# EasyEDA Pro project ProProject_遥控手柄PCB_2024-01-29.epro

# Schematic Schematic1
Create Date: 2024-01-29; Page Name: P1; Project Name: 遥控手柄PCB; Schematic Name: Schematic1; Update Date: 2024-01-29; Company: 嘉立创EDA; Page Size: A4; Version: V1.0
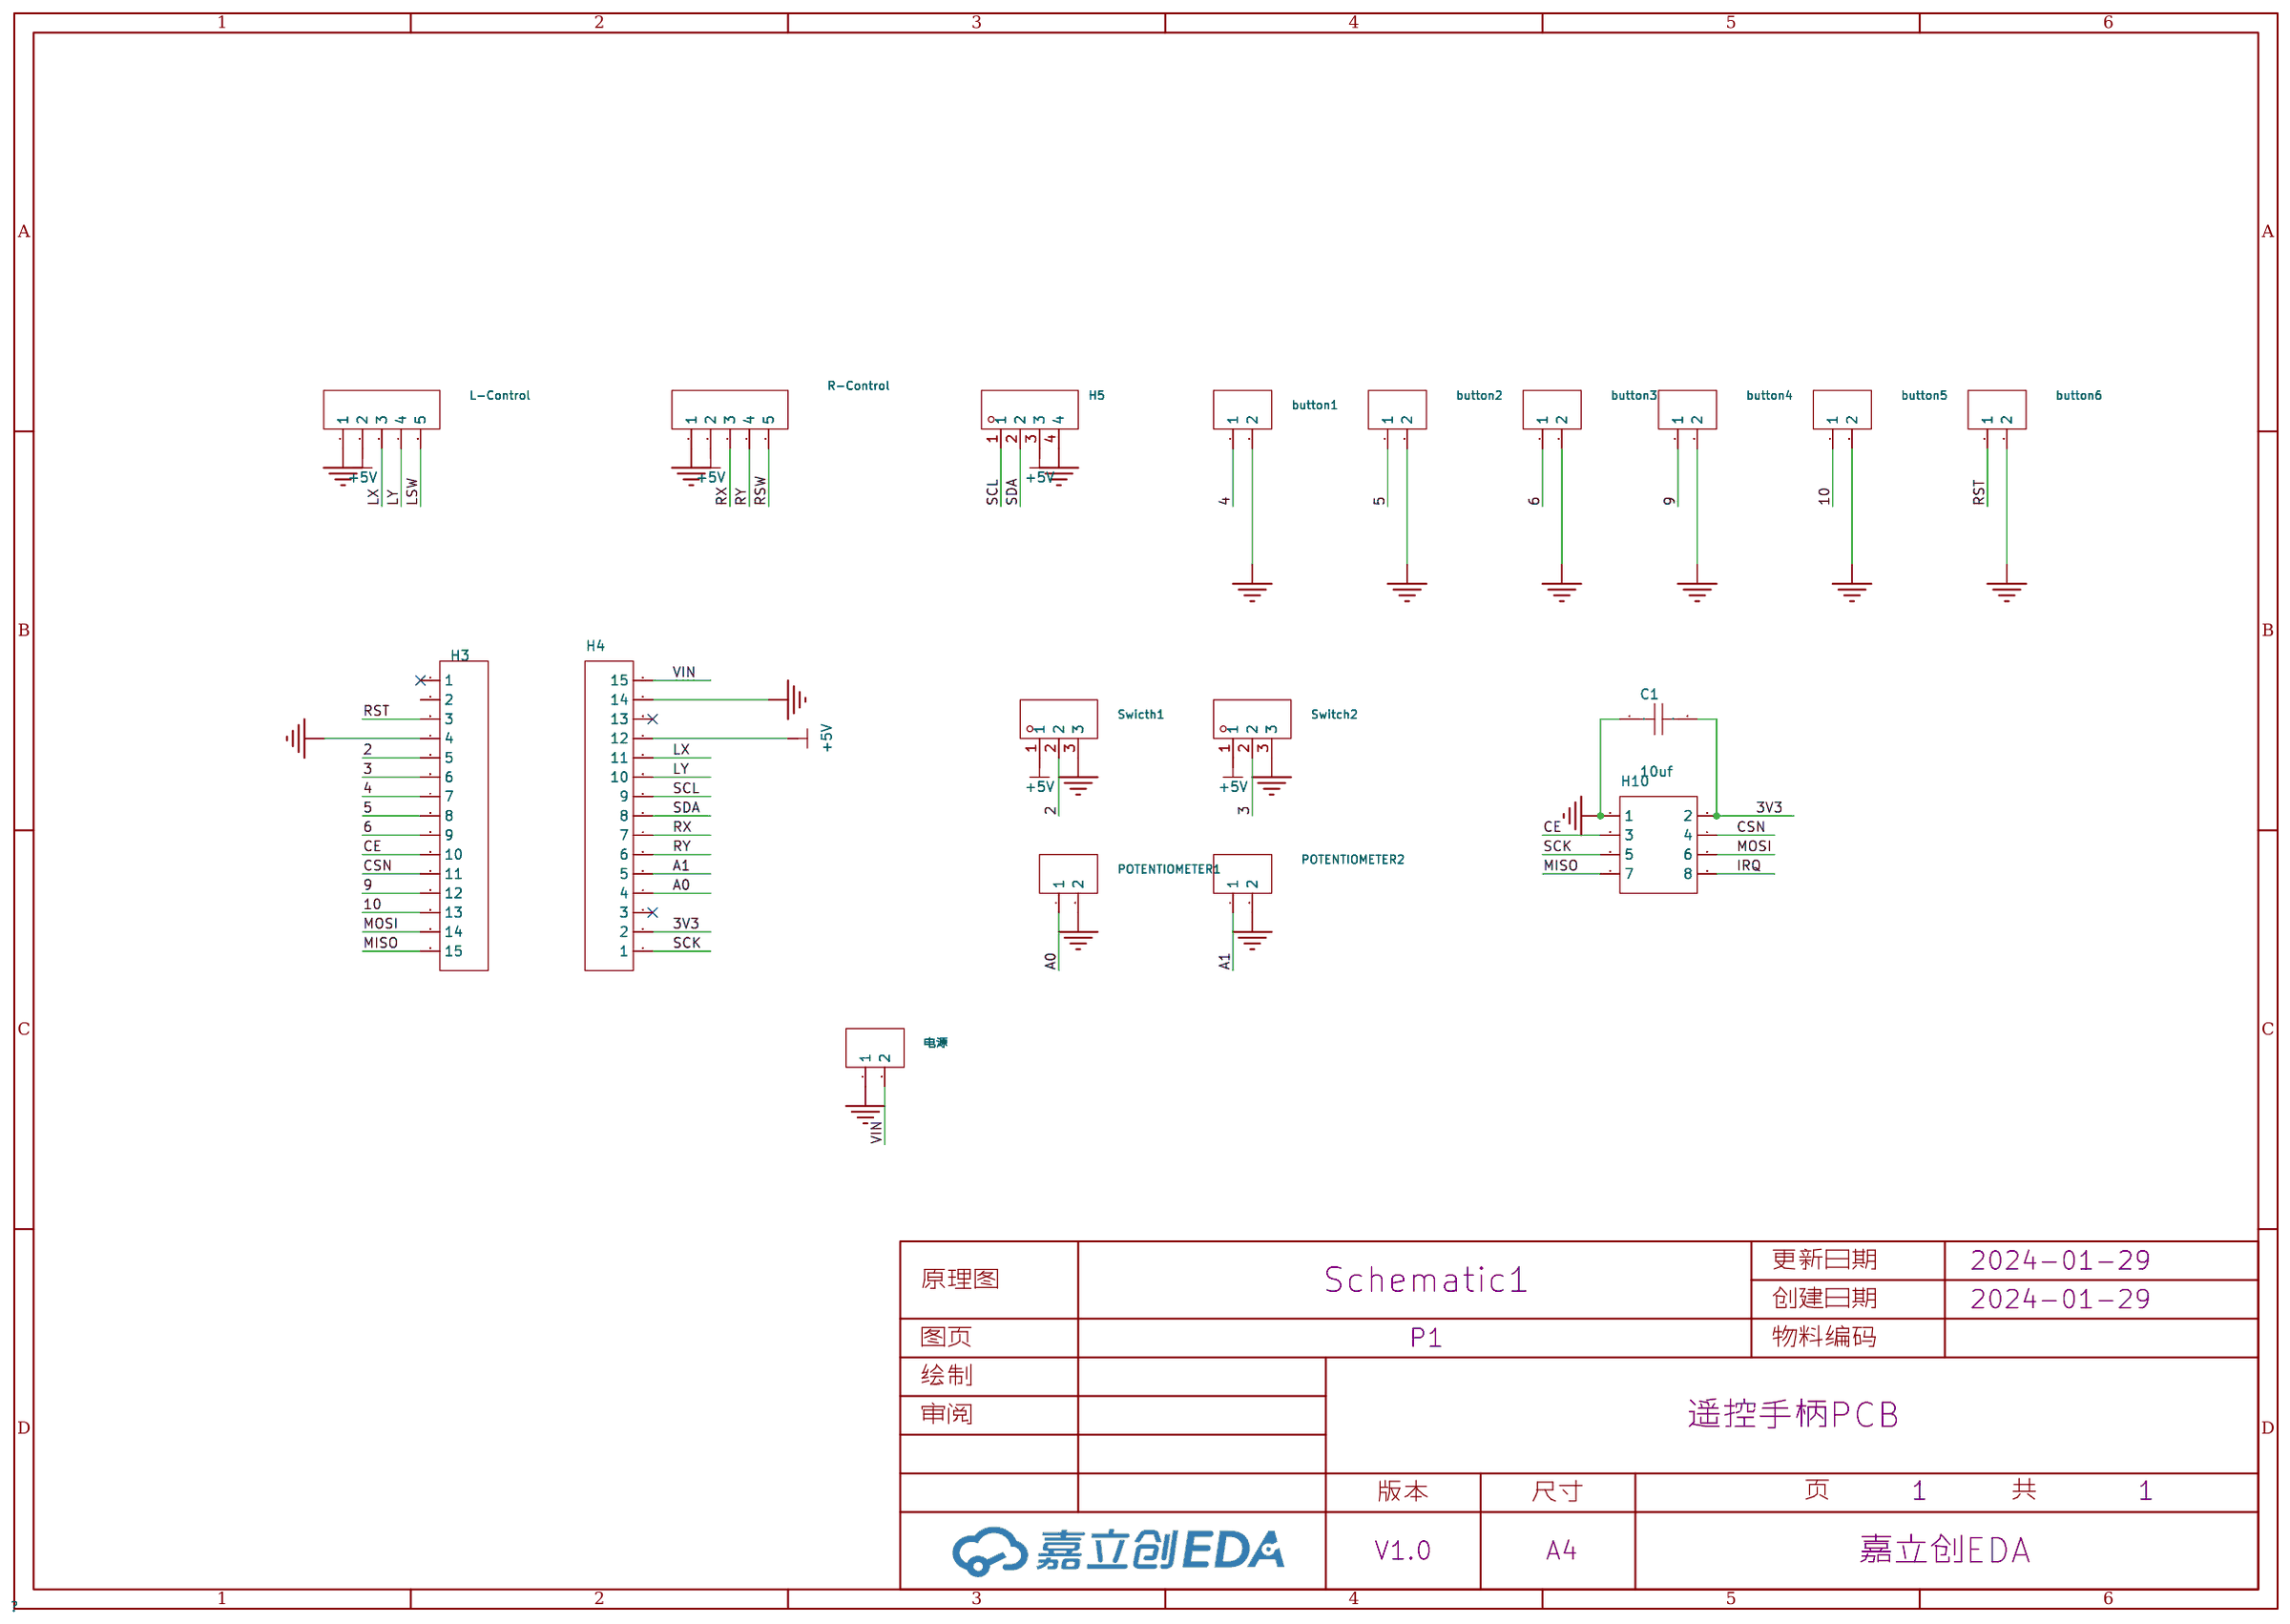
[diagram p0: schematic sheet]

## Parts
button1  -  [HDR-TH_2P-P2.54-V-F]
button2  -  [HDR-TH_2P-P2.54-V-F]
button3  -  [HDR-TH_2P-P2.54-V-F]
button4  -  [HDR-TH_2P-P2.54-V-F]
button5  -  [HDR-TH_2P-P2.54-V-F]
button6  -  [HDR-TH_2P-P2.54-V-F]
C1  10uf  [C0805]
H3  -  [HDR-TH_15P-P2.54-V-F-1]
H4  -  [HDR-TH_15P-P2.54-V-F-1]
H5  -  [HDR-TH_4P-P2.54-V-F]
H10  -  [HDR-TH_8P-P2.54-V-F-R2-C4-S2.54-1]
L-Control  -  [HDR-TH_5P-P2.54-V-F]
POTENTIOMETER1  -  [HDR-TH_2P-P2.54-V-F]
POTENTIOMETER2  -  [HDR-TH_2P-P2.54-V-F]
R-Control  -  [HDR-TH_5P-P2.54-V-F]
Swicth1  -  [HDR-TH_3P-P2.54-V-F]
Switch2  -  [HDR-TH_3P-P2.54-V-F]
电源  -  [HDR-TH_2P-P2.54-V-F]

## Library data of the parts
button1-button6 POTENTIOMETER1 POTENTIOMETER2 电源 = HDR-F_2.54_1x2P: Supplier Part: C49661; Supplier Footprint: 插件
C1 = CAP_0805: Supplier Footprint: 0805
H3 H4 = HDR-F_2.54_1x15P: Supplier Part: C124408; Supplier Footprint: 插件,
H5 = HDR-F_2.54_1x4P: Supplier Part: C2718488; Supplier Footprint: 插件
H10 = HDR-F_2.54_2x4: Supplier Part: C92271; Supplier Footprint: 插件
L-Control R-Control = HDR-F_2.54_1x5P: Supplier Part: C50950; Supplier Footprint: 插件
Swicth1 Switch2 = HDR-F_2.54_1x3P: Supplier Part: C541850; Supplier Footprint: 插件

## Nets
3V3: C1.2 H4.2 H10.2
+5V: H4.12 H5.3 L-Control.2 R-Control.2 Swicth1.1 Switch2.1
GND: button1.2 button2.2 button3.2 button4.2 button5.2 button6.2 C1.1 H3.4 H4.14 H5.4 H10.1 L-Control.1 POTENTIOMETER1.2 POTENTIOMETER2.2 R-Control.1 Swicth1.3 Switch2.3 电源.1
VIN: H4.15 电源.2
2: H3.5 Swicth1.2
3: H3.6 Switch2.2
4: button1.1 H3.7
5: button2.1 H3.8
6: button3.1 H3.9
9: button4.1 H3.12
10: button5.1 H3.13
A0: H4.4 POTENTIOMETER1.1
A1: H4.5 POTENTIOMETER2.1
CE: H3.10 H10.3
CSN: H3.11 H10.4
IRQ: H10.8
LSW: L-Control.5
LX: H4.11 L-Control.3
LY: H4.10 L-Control.4
MISO: H3.15 H10.7
MOSI: H3.14 H10.6
RST: button6.1 H3.3
RSW: R-Control.5
RX: H4.7 R-Control.3
RY: H4.6 R-Control.4
SCK: H4.1 H10.5
SCL: H4.9 H5.1
SDA: H4.8 H5.2

Not connected (* = marked no-connect by the designer): H3 1* 2; H4 3* 13*

# Board PCB1
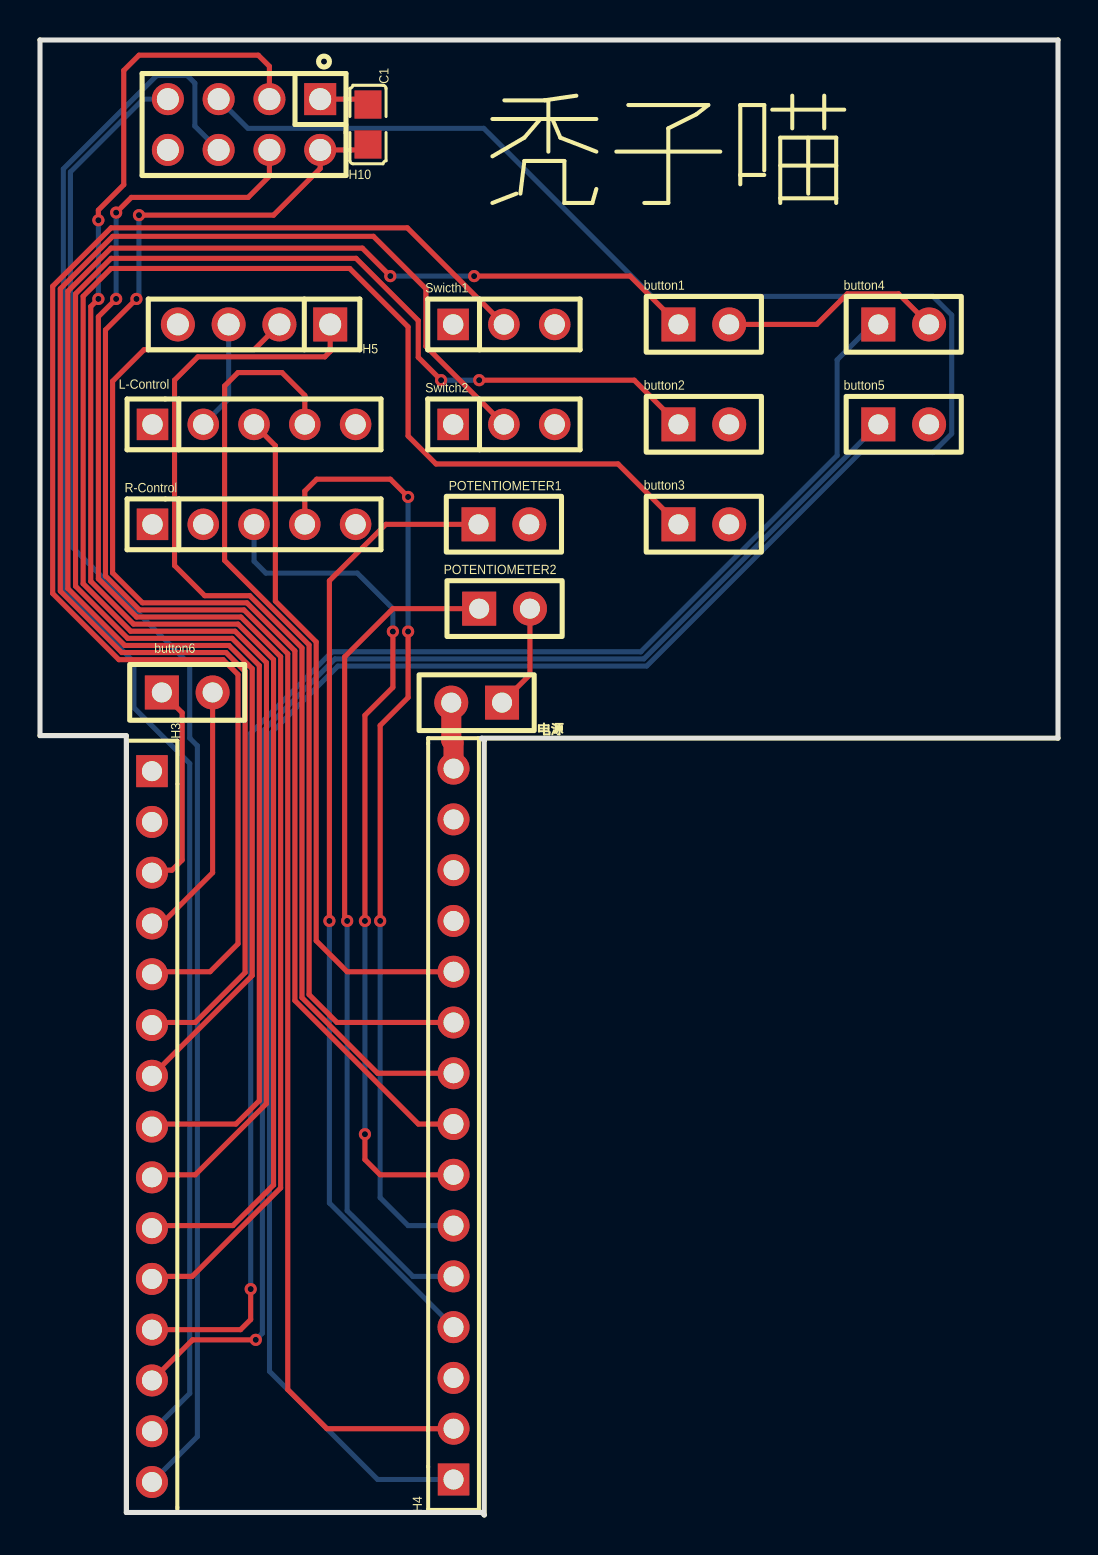
[diagram p1: board, top side]
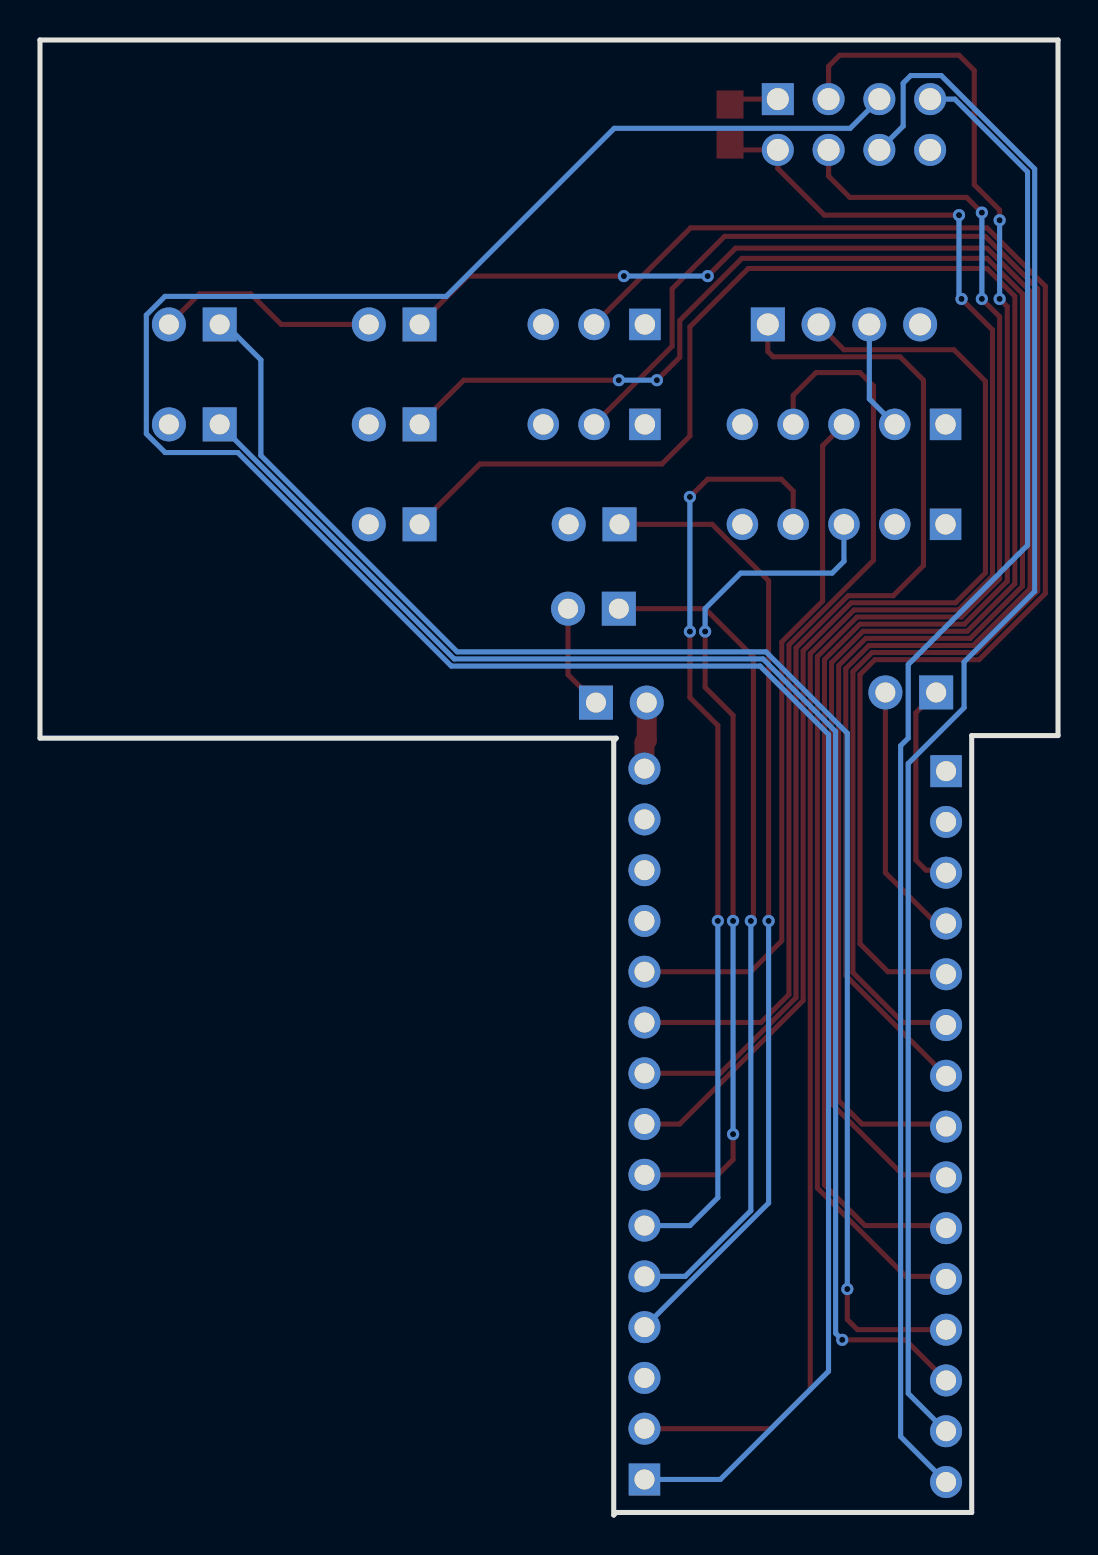
[diagram p2: board, bottom side, seen from below]

Outline 50.93 x 73.79 mm; copper layers: Top Layer, Bottom Layer. Coordinates in mm from the lower left corner of the outline.
Outline path: 0,73.79 0,38.99 4.32,38.99 4.32,0.13 22.1,0.13 22.22,0 22.22,38.73 22.1,38.86 50.93,38.86 50.93,73.79 0,73.79
Stack: Top Layer 0.035mm / Dielectric1 1.51mm FR4 er 4.5 / Bottom Layer 0.035mm

## Design rules (mm)
template: JLCPCB Capability(Two Layers Board)
spacing copperThickness1oz (default): track to track 0.102, other pairs 0.152 to 0.3
spacing copperThickness2oz: track to track 0.203, other pairs 0.152 to 0.3
track width copperThickness1oz (default): min 0.127, default 0.254, max 2.54
track width copperThickness2oz: min 0.203, default 0.254, max 2.54
differential pair differentialPair (default): width min 0.127, default 0.254, max 2.54; gap min 0.152, default 0.152
via viaSize (default): diameter min 0.5, default 0.61, max 10; hole min 0.3, default 0.305, max 6.3

## Placement (name value [footprint] x y rotation side)
button1  -  [HDR-TH_2P-P2.54-V-F]  33.21 59.56 0 top
button2  -  [HDR-TH_2P-P2.54-V-F]  33.21 54.56 0 top
button3  -  [HDR-TH_2P-P2.54-V-F]  33.21 49.56 0 top
button4  -  [HDR-TH_2P-P2.54-V-F]  43.21 59.56 0 top
button5  -  [HDR-TH_2P-P2.54-V-F]  43.21 54.56 0 top
button6  -  [HDR-TH_2P-P2.54-V-F]  7.37 41.15 0 top
C1  10uf  [C0805]  16.41 69.56 270 top
H3  -  [HDR-TH_15P-P2.54-V-F-1]  5.6 19.43 270 top
H4  -  [HDR-TH_15P-P2.54-V-F-1]  20.69 19.56 90 top
H5  -  [HDR-TH_4P-P2.54-V-F]  10.71 59.56 180 top
H10  -  [HDR-TH_8P-P2.54-V-F-R2-C4-S2.54-1]  10.21 69.56 180 top
L-Control  -  [HDR-TH_5P-P2.54-V-F]  10.71 54.56 0 top
POTENTIOMETER1  -  [HDR-TH_2P-P2.54-V-F]  23.21 49.56 0 top
POTENTIOMETER2  -  [HDR-TH_2P-P2.54-V-F]  23.24 45.34 0 top
R-Control  -  [HDR-TH_5P-P2.54-V-F]  10.71 49.56 0 top
Swicth1  -  [HDR-TH_3P-P2.54-V-F]  23.21 59.56 0 top
Switch2  -  [HDR-TH_3P-P2.54-V-F]  23.21 54.56 0 top
电源  -  [HDR-TH_2P-P2.54-V-F]  21.84 40.64 180 top

## Footprints (pads in the part's own frame, mm; a bottom-side part is the same pattern mirrored in y, then rotated)
C0805
  rect 1.41x1.35 smd: 1(-1,0) 2(1,0)
HDR-TH_2P-P2.54-V-F
  rect 1.7x1.7 hole 1: 1(-1.27,0)
  round 1.7 hole 1: 2(1.27,0)
HDR-TH_3P-P2.54-V-F
  rect 1.575x1.575 hole 1.02: 1(-2.54,0)
  round 1.575 hole 1.02: 2(0,0) 3(2.54,0)
HDR-TH_4P-P2.54-V-F
  rect 1.7x1.7 hole 1.1: 1(-3.81,0)
  round 1.7 hole 1.1: 2(-1.27,0) 3(1.27,0) 4(3.81,0)
HDR-TH_5P-P2.54-V-F
  rect 1.575x1.575 hole 1.02: 1(-5.08,0)
  round 1.575 hole 1.02: 2(-2.54,0) 3(0,0) 4(2.54,0) 5(5.08,0)
HDR-TH_8P-P2.54-V-F-R2-C4-S2.54-1
  rect 1.6x1.6 hole 1.1: 1(-3.81,-1.27)
  round 1.6 hole 1.1: 2(-3.81,1.27) 3(-1.27,-1.27) 4(-1.27,1.27) 5(1.27,-1.27) 6(1.27,1.27) 7(3.81,-1.27) 8(3.81,1.27)
HDR-TH_15P-P2.54-V-F-1
  rect 1.6x1.575 hole 1: 1(-17.78,0)
  round 1.6 hole 1: 2(-15.24,0) 3(-12.7,0) 4(-10.16,0) 5(-7.62,0) 6(-5.08,0) 7(-2.54,0) 8(0,0) 9(2.54,0) 10(5.08,0) 11(7.62,0) 12(10.16,0) 13(12.7,0) 14(15.24,0) 15(17.78,0)

## Nets
As in the schematic.

Pads without a net: H3 1 2; H4 3 13

## Via types
v1: diameter 0.61, hole 0.305, Top Layer to Bottom Layer, 20 vias

## Routing (per net, layer and track width the routed paths; a pad name or vN(x,y) marks a point on that pad's centre or on a via; arc(x,y) is an arc through that point)
3V3: length 88.8
  Top Layer w0.254: v1(4.83,60.83) 3.28,59.28 3.28,46.98 4.98,45.28 10.2,45.28 12.4,43.08 12.4,6.27 14.35,4.32 H4.2 ; C1.2 16.14,68.29 H10.2 14.02,67.36 11.68,65.02 v1(4.95,65.02)
  Bottom Layer w0.254: v1(4.83,60.83) 4.95,60.96 v1(4.95,65.02)
+5V: length 5.5
  Bottom Layer w0.254: L-Control.2 9.44,55.83 H5.3
GND: length 32.2
  Top Layer w0.254: button6.2 8.64,32.13 6.1,29.59 H3.4 ; button4.2 42.95,61.09 40.39,61.09 38.86,59.56 button1.2 ; POTENTIOMETER2.2 24.51,42.04 电源.1 ; H10.1 16.14,70.83 C1.1
VIN: length 3.3
  Top Layer w1: 电源.2 20.57,38.75 20.69,38.64 H4.15
2: length 70.3
  Top Layer w0.254: Swicth1.2 18.38,64.39 3.56,64.39 0.64,61.47 0.64,46.1 3.95,42.79 9.16,42.79 9.91,42.04 9.91,28.57 8.51,27.18 5.73,27.18
3: length 75.5
  Top Layer w0.254: 5.73,24.64 7.76,24.64 10.26,27.13 10.26,42.19 9.31,43.14 4.1,43.14 1.02,46.22 1.02,61.34 3.64,63.96 16.68,63.96 19.3,61.34 19.3,58.46 Switch2.2
4: length 81
  Top Layer w0.254: 5.73,22.1 10.62,26.99 10.62,42.34 9.46,43.5 4.24,43.5 1.4,46.34 1.4,61.22 3.55,63.37 16.13,63.37 v1(17.53,61.98) ; button1.1 29.52,61.98 v1(21.72,61.98)
  Bottom Layer w0.254: v1(21.72,61.98) v1(17.53,61.98)
5: length 88.4
  Top Layer w0.254: button2.1 29.73,56.77 v1(21.97,56.77) ; 5.73,19.56 9.8,19.56 10.97,20.73 10.97,42.49 9.61,43.85 4.39,43.85 1.78,46.47 1.78,61.09 3.56,62.86 15.81,62.86 18.92,59.75 18.92,57.91 v1(20.07,56.77)
  Bottom Layer w0.254: v1(20.07,56.77) v1(21.97,56.77)
6: length 93.2
  Top Layer w0.254: 5.73,17.02 7.76,17.02 11.33,20.58 11.33,42.64 9.76,44.21 4.54,44.21 2.16,46.59 2.16,60.96 3.55,62.36 15.49,62.36 18.41,59.44 18.41,53.97 19.81,52.58 28.92,52.58 button3.1
9: length 77.2
  Top Layer w0.254: H3.12 10.03,9.27 10.54,9.78 v1(10.54,11.3)
  Bottom Layer w0.254: button4.1 41.82,59.44 41.53,59.44 39.88,57.78 39.88,53 30.06,43.18 14.61,43.18 10.54,39.11 v1(10.54,11.3)
10: length 73.8
  Top Layer w0.254: H3.13 7.63,8.76 v1(10.79,8.76)
  Bottom Layer w0.254: v1(10.79,8.76) 11.13,9.09 11.13,39.19 14.76,42.82 30.2,42.82 button5.1
A0: length 48.5
  Top Layer w0.254: POTENTIOMETER1.1 17.3,49.56 14.48,46.74 v1(14.48,29.72)
  Bottom Layer w0.254: v1(14.48,29.72) 14.48,15.61 H4.4
A1: length 42.2
  Top Layer w0.254: v1(15.37,29.72) 15.24,29.72 15.24,42.93 17.65,45.34 21.97,45.34
  Bottom Layer w0.254: H4.5 18.65,11.94 15.37,15.22 v1(15.37,29.72)
CE: length 79.6
  Top Layer w0.254: H10.3 11.48,72.47 10.92,73.02 4.95,73.02 4.19,72.26 4.19,66.55 2.92,65.28 v1(2.92,64.77) ; 5.73,14.48 9.65,14.48 11.68,16.51 11.68,42.79 9.91,44.57 4.68,44.57 2.54,46.71 2.54,60.45 v1(2.92,60.83)
  Bottom Layer w0.254: v1(2.92,64.77) v1(2.92,60.83)
CSN: length 73.9
  Top Layer w0.254: H10.4 11.48,66.98 10.41,65.91 4.57,65.91 v1(3.81,65.15) ; 5.73,11.94 7.62,11.94 12.04,16.36 12.04,42.94 10.05,44.92 4.83,44.92 2.92,46.83 2.92,59.94 v1(3.81,60.83)
  Bottom Layer w0.254: v1(3.81,65.15) v1(3.81,60.83)
LX: length 34.6
  Top Layer w0.254: H4.11 15.37,27.18 13.82,28.73 13.82,43.67 11.78,45.72 11.78,53.49 L-Control.3
LY: length 46.2
  Top Layer w0.254: H4.10 14.86,24.64 13.46,26.03 13.46,43.53 9.23,47.75 9.23,56.48 9.91,57.15 12.1,57.15 13.25,56.01 L-Control.4
MISO: length 75.5
  Bottom Layer w0.254: H10.7 5.16,70.83 1.52,67.19 1.52,48.51 7.49,42.54 7.49,38.86 7.87,38.48 7.87,3.92 5.6,1.65
MOSI: length 79.1
  Bottom Layer w0.254: H3.14 7.49,6.08 7.49,37.59 4.7,40.39 4.7,42.67 1.17,46.2 1.17,67.34 5.84,72.01 7.37,72.01 7.75,71.63 7.75,69.48 H10.6
RST: length 10.4
  Top Layer w0.254: 5.73,32.26 6.6,32.26 7.11,32.77 7.11,40.13 button6.1
RX: length 42.7
  Top Layer w0.254: v1(16.26,29.72) 16.26,40 17.65,41.4 v1(17.65,44.2) ; H4.7 17.02,17.02 16.26,17.78 v1(16.26,19.05)
  Bottom Layer w0.254: v1(16.26,29.72) v1(16.26,19.05) ; R-Control.3 10.71,47.71 11.3,47.12 15.88,47.12 17.65,45.34 v1(17.65,44.2)
RY: length 47.5
  Top Layer w0.254: R-Control.4 13.25,51.22 13.84,51.82 17.53,51.82 v1(18.41,50.93) ; v1(17.02,29.72) 17.02,39.5 18.41,40.89 v1(18.41,44.2)
  Bottom Layer w0.254: H4.6 18.41,14.48 17.02,15.87 v1(17.02,29.72) ; v1(18.41,50.93) 18.41,44.32 18.54,44.2 v1(18.41,44.2)
SCK: length 130.7
  Bottom Layer w0.254: H10.5 10.4,69.37 22.2,69.37 30.61,60.96 44.67,60.96 45.61,60.03 45.61,54.09 44.67,53.15 41.03,53.15 30.35,42.47 14.9,42.47 11.48,39.04 11.48,7.19 16.89,1.78 H4.1
SCL: length 53.7
  Top Layer w0.254: H4.9 16.89,22.1 13.11,25.88 13.11,43.38 10.5,45.99 8.24,45.99 6.73,47.5 6.73,56.77 7.9,57.94 14.25,57.94 14.52,58.21 H5.1
SDA: length 57.8
  Top Layer w0.254: H5.2 10.71,58.29 5.21,58.29 3.63,56.72 3.63,47.13 5.13,45.63 10.35,45.63 12.75,43.23 12.75,25.74 18.93,19.56 H4.8

## Copper pours and planes (outline as drawn; the poured copper is in the pictures)
+5V on Top Layer: -9.91,81.79 67.06,81.79 67.06,-9.14 -9.91,-9.14
GND on Bottom Layer: -5.59,78.1 61.47,78.1 61.47,-8.13 -5.59,-8.13

## Text on the board
Top Silkscreen Layer: 秃子喵
